# Altium schematic sheet 电子脚铐手持式主控板_RS232.SchDoc
size A4
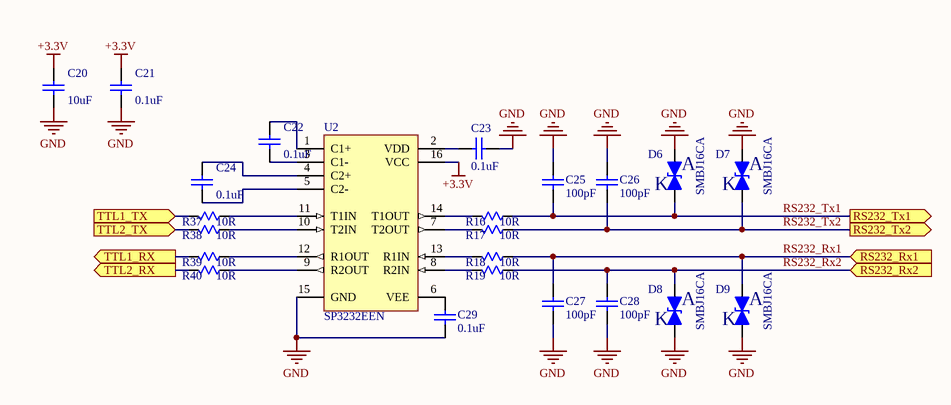
[diagram p0: 电子脚铐手持式主控板_RS232.SchDoc]

## Parts
C20  10uF  [C0603]
C21  0.1uF  [C0603]
C22  0.1uF  [C0603]
C23  0.1uF  [C0603]
C24  0.1uF  [C0603]
C25  100pF  [C0603]
C26  100pF  [C0603]
C27  100pF  [C0603]
C28  100pF  [C0603]
C29  0.1uF  [C0603]
D6  SMBJ16CA  [SMB]
D7  SMBJ16CA  [SMB]
D8  SMBJ16CA  [SMB]
D9  SMBJ16CA  [SMB]
R16  10R  [R0603]
R17  10R  [R0603]
R18  10R  [R0603]
R19  10R  [R0603]
R37  10R  [R0603]
R38  10R  [R0603]
R39  10R  [R0603]
R40  10R  [R0603]
U2  SP3232EEN  [SO16]

## Ports
RS232_Rx1 (in), RS232_Rx2 (in), RS232_Tx1 (out), RS232_Tx2 (out), TTL1_RX (out), TTL1_TX (in), TTL2_RX (out), TTL2_TX (in)

## Nets
+3.3V: C20.1 C21.1 U2.16(VCC)
GND: C20.2 C21.2 C23.1 C25.1 C26.1 C27.2 C28.2 C29.1 D6.1(A) D7.1(A) D8.2(K) D9.2(K) U2.15(GND)
RS232_Rx1: C27.1 D9.1(A) R18.2 ; port RS232_Rx1
RS232_Rx2: C28.1 D8.1(A) R19.2 ; port RS232_Rx2
RS232_Tx1: C25.2 D6.2(K) R16.2 ; port RS232_Tx1
RS232_Tx2: C26.2 D7.2(K) R17.2 ; port RS232_Tx2
TTL1_RX: R39.1 ; port TTL1_RX
TTL1_TX: R37.1 ; port TTL1_TX
TTL2_RX: R40.1 ; port TTL2_RX
TTL2_TX: R38.1 ; port TTL2_TX
NetC22_1: C22.1 U2.1(C1+)
NetC22_2: C22.2 U2.3(C1-)
NetC23_2: C23.2 U2.2(VDD)
NetC24_1: C24.1 U2.4(C2+)
NetC24_2: C24.2 U2.5(C2-)
NetC29_2: C29.2 U2.6(VEE)
NetR16_1: R16.1 U2.14(T1OUT)
NetR17_1: R17.1 U2.7(T2OUT)
NetR18_1: R18.1 U2.13(R1IN)
NetR19_1: R19.1 U2.8(R2IN)
NetR37_2: R37.2 U2.11(T1IN)
NetR38_2: R38.2 U2.10(T2IN)
NetR39_2: R39.2 U2.12(R1OUT)
NetR40_2: R40.2 U2.9(R2OUT)

## Notes on the sheet
- 文件名:
- 审核:
- 制图人:
- 孟浩
- 校对:
- 图号:
- 批准:
- 日期:

## Library data of the parts
C20-C29 = CAP: Published: 8-Jun-2000; LatestRevisionDate: 17-Jul-2002; LatestRevisionNote: Re-released for DXP Platform.; PackageReference: RAD-0.3; Publisher: Altium Limited
D6-D9 = BS0300N
R16-R19 R37-R40 = Res: Resistor; Published: 8-Jun-2000; LatestRevisionDate: 04-Mar-2005; LatestRevisionNote: PCB Footprint replaced.; PackageReference: J1-0603; Publisher: Altium Limited
U2 = MAX232ACPE: +5V Powered, Multi-Channel RS-232 Driver/Receiver; Manufacturer: Maxim; Class: Communication; SubClass: Transceiver; Published: 16/01/2001; Publisher: Altium Hobart Technology Centre